# Altium schematic sheet sch_arduboy.SchDoc
size A4
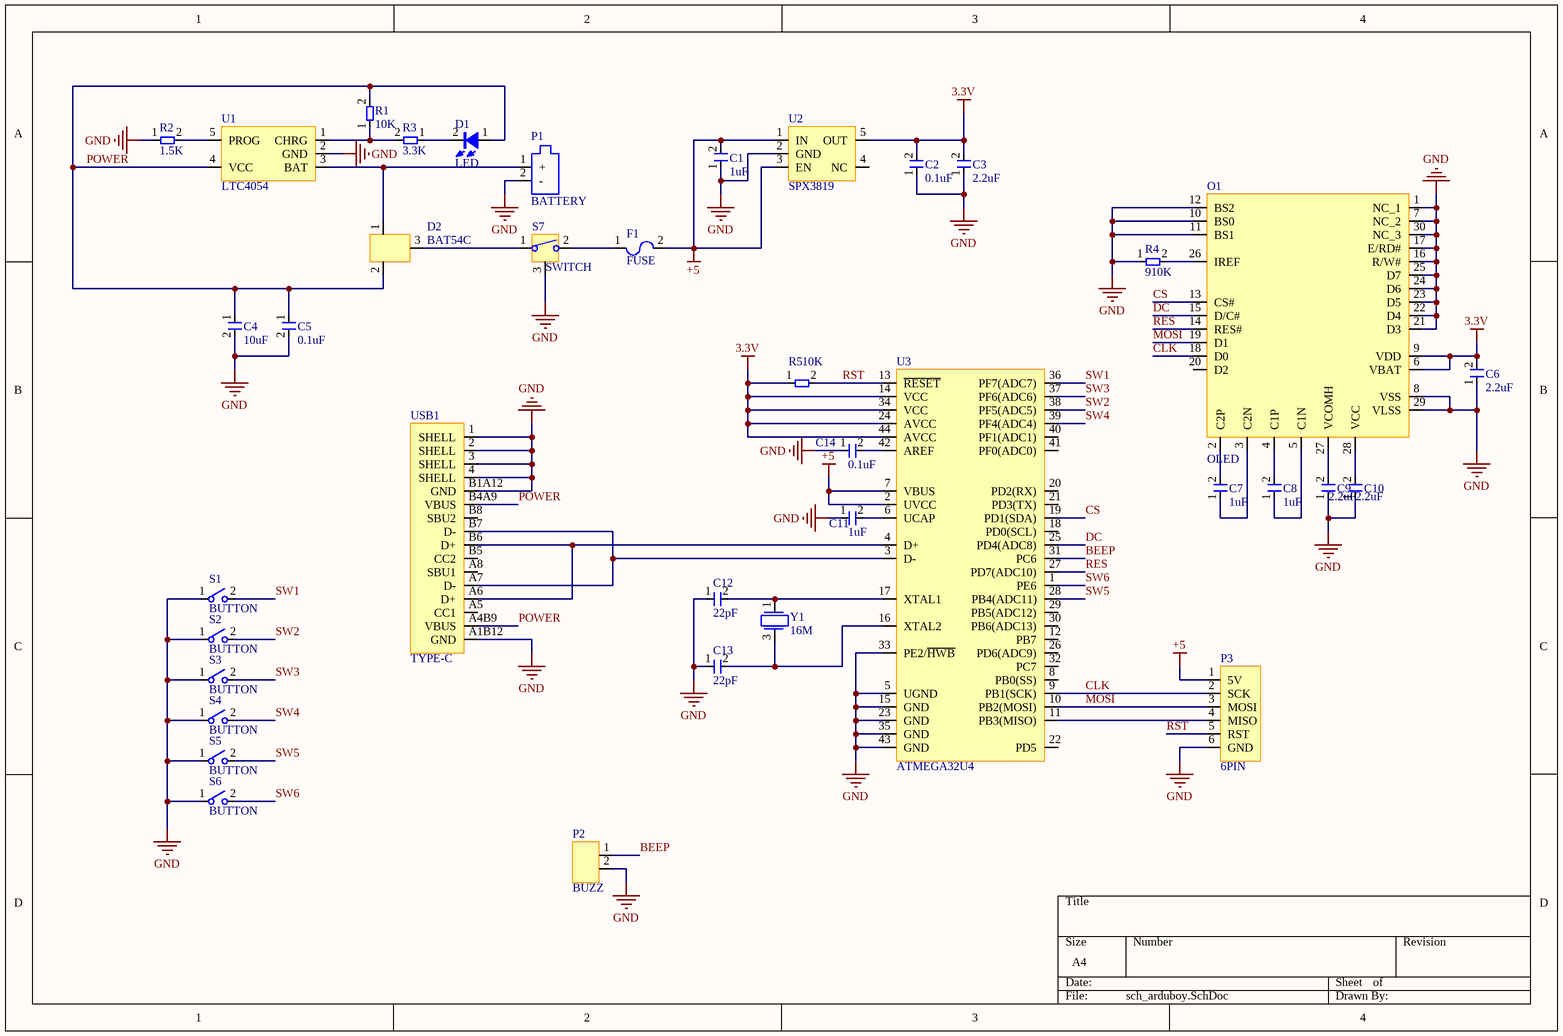
[diagram p0: sch_arduboy.SchDoc]

## Parts
C1  1uF  [CAP0603]
C2  0.1uF  [CAP0603]
C3  2.2uF  [CAP0603]
C4  10uF  [10uFCAP3216]
C5  0.1uF  [CAP0603]
C6  2.2uF  [CAP0603]
C7  1uF  [CAP0603]
C8  1uF  [CAP0603]
C9  2.2uF  [CAP0603]
C10  2.2uF  [CAP0603]
C11  1uF  [CAP0603]
C12  22pF  [CAP0603]
C13  22pF  [CAP0603]
C14  0.1uF  [CAP0603]
D1  LED  [LED0603]
D2  BAT54C  [BAT54CSOT23-3]
F1  FUSE  [FUSE1206]
O1  OLED  [OLED30P]
P1  BATTERY  [BATTERY]
P2  BUZZ  [BUZZ]
P3  6PIN  [6PIN254]
R1  10K  [RES0805]
R2  1.5K  [RES0805]
R3  3.3K  [RES0805]
R4  910K  [RES0805]
R5  10K  [RES0805]
S1  BUTTON  [SKP_BUTTON]
S2  BUTTON  [SKP_BUTTON]
S3  BUTTON  [SKP_BUTTON]
S4  BUTTON  [SKP_BUTTON]
S5  BUTTON  [SKP_BUTTON]
S6  BUTTON  [SKP_BUTTON]
S7  SWITCH  [SWITCH_BUTTON]
U1  LTC4054  [LTC4054]
U2  SPX3819  [SPX3819]
U3  ATMEGA32U4  [ATMEGA32U4AU]
USB1  TYPE-C  [TYPE-C]
Y1  16M  [CRYSTAL]

## Nets
3.3V: C2.2 C3.2 C6.2 O1.6(VBAT) O1.9(VDD) R5.1 U2.5(OUT) U3.14(VCC) U3.24(AVCC) U3.34(VCC) U3.44(AVCC)
+5: C1.2 F1.2 P3.1(5V) U2.1(IN) U2.3(EN) U3.2(UVCC) U3.7(VBUS)
GND: C1.1 C2.1 C3.1 C4.2 C5.2 C6.1 C9.1 C10.1 C11.1 C12.1 C13.1 C14.1 O1.1(NC_1) O1.7(NC_2) O1.8(VSS) O1.10(BS0) O1.11(BS1) O1.12(BS2) O1.16(R/W#) O1.17(E/RD#) O1.21(D3) O1.22(D4) O1.23(D5) O1.24(D6) O1.25(D7) O1.29(VLSS) O1.30(NC_3) P1.2(-) P2.2 P3.6(GND) R2.1 R4.1 S1.1 S2.1 S3.1 S4.1 S5.1 S6.1 S7.3 U1.2(GND) U2.2(GND) U3.5(UGND) U3.15(GND) U3.23(GND) U3.33(PE2/~{HWB}) U3.35(GND) U3.43(GND) USB1.1(SHELL) USB1.2(SHELL) USB1.3(SHELL) USB1.4(SHELL) USB1.A1B12(GND) USB1.B1A12(GND)
BEEP: P2.1 U3.31(PC6)
CLK: O1.18(D0) P3.2(SCK) U3.9(PB1(SCK))
CS: O1.13(CS#) U3.19(PD1(SDA))
DC: O1.15(D/C#) U3.25(PD4(ADC8))
MOSI: O1.19(D1) P3.3(MOSI) U3.10(PB2(MOSI))
POWER: C4.1 C5.1 D1.1 D2.2 R1.2 U1.4(VCC) USB1.A4B9(VBUS) USB1.B4A9(VBUS)
RES: O1.14(RES#) U3.27(PD7(ADC10))
RST: P3.5(RST) R5.2 U3.13(~{RESET})
SW1: S1.2 U3.36(PF7(ADC7))
SW2: S2.2 U3.38(PF5(ADC5))
SW3: S3.2 U3.37(PF6(ADC6))
SW4: S4.2 U3.39(PF4(ADC4))
SW5: S5.2 U3.28(PB4(ADC11))
SW6: S6.2 U3.1(PE6)
NetC7_1: C7.1 O1.3(C2N)
NetC7_2: C7.2 O1.2(C2P)
NetC8_1: C8.1 O1.5(C1N)
NetC8_2: C8.2 O1.4(C1P)
NetC9_2: C9.2 O1.27(VCOMH)
NetC10_2: C10.2 O1.28(VCC)
NetC11_2: C11.2 U3.6(UCAP)
NetC12_2: C12.2 U3.17(XTAL1) Y1.1
NetC13_2: C13.2 U3.16(XTAL2) Y1.3
NetC14_2: C14.2 U3.42(AREF)
NetD1_2: D1.2 R3.1
NetD2_1: D2.1 P1.1(+) U1.3(BAT)
NetD2_3: D2.3 S7.1
NetF1_1: F1.1 S7.2
NetO1_26: O1.26(IREF) R4.2
NetP3_4: P3.4(MISO) U3.11(PB3(MISO))
NetR1_1: R1.1 R3.2 U1.1(CHRG)
NetR2_2: R2.2 U1.5(PROG)
NetU3_3: U3.3(D-) USB1.A7(D-) USB1.B7(D-)
NetU3_4: U3.4(D+) USB1.A6(D+) USB1.B6(D+)

Not connected (* = marked no-connect by the designer): O1 20(D2); U2 4(NC); U3 8(PB0(SS)) 12(PB7) 18(PD0(SCL)) 20(PD2(RX)) 21(PD3(TX)) 22(PD5) 26(PD6(ADC9)) 29(PB5(ADC12)) 30(PB6(ADC13)) 32(PC7) 40(PF1(ADC1)) 41(PF0(ADC0)); USB1 A5(CC1) A8(SBU1) B5(CC2) B8(SBU2)

## Library data of the parts
C1-C14 = CAP
O1 = OLED: 0.96 128x64OLED
R1-R5 = RES: 电阻
Y1 = CRYSTAL